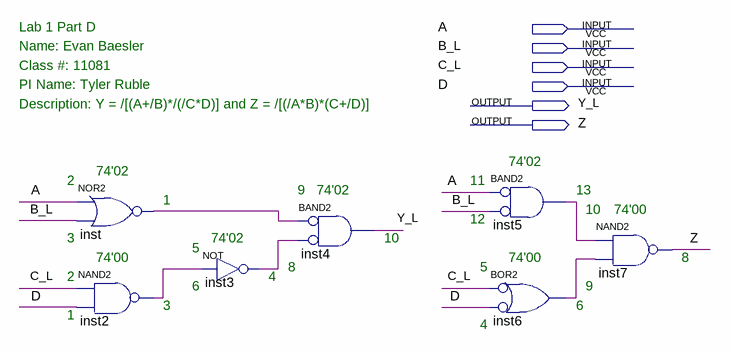
[diagram p0: schematic sheet]
// Quartus schematic lab1d.bdf as structural Verilog: 7 symbols, 6 pins
module lab1d (
  input  A,
  input  B_L,
  input  C_L,
  input  D,
  output Y_L,
  output Z
);

  wire inst2_out, inst3_out, inst5_out, inst6_out, inst_out;

  nor inst (inst_out, A, B_L);
  nand inst2 (inst2_out, C_L, D);
  not inst3 (inst3_out, inst2_out);
  and inst4 (Y_L, ~inst_out, ~inst3_out);  // BAND2
  and inst5 (inst5_out, ~A, ~B_L);  // BAND2
  or inst6 (inst6_out, ~C_L, ~D);  // BOR2
  nand inst7 (Z, inst5_out, inst6_out);

  // Notes on the sheet:
  //   Lab 1 Part D
  //   Name: Evan Baesler
  //   Class #: 11081
  //   PI Name: Tyler Ruble
  //   Description: Y = /[(A+/B)*/(/C*D)] and Z = /[(/A*B)*(C+/D)]
  //   74'02
  //   74'02
  //   2
  //   11
  //   9
  //   74'02
  //   13
  //   1
  //   10
  //   74'00
  //   12
  //   3
  //   74'02
  //   10
  //   5
  //   74'00
  //   74'00
  //   8
  //   8
  //   5
  //   2
  //   4
  //   6
  //   9
  //   3
  //   6
  //   1
  //   4
endmodule
